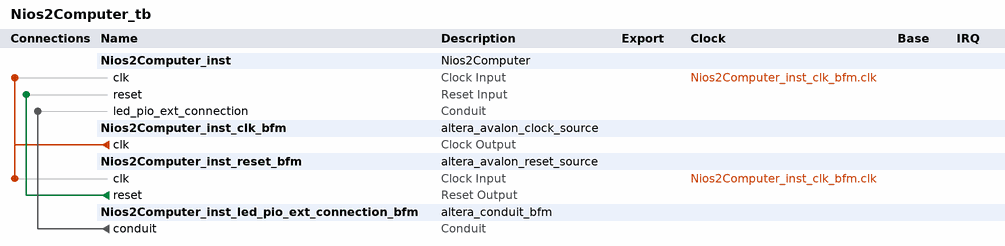
[diagram p0: system contents]
# Platform Designer (Qsys) system Nios2Computer_tb, Cyclone V 5CSEMA4U23C6
# Parameters at their usual value, and those the tool derives, are not listed.
package require -exact qsys 17.1
create_system Nios2Computer_tb
set_project_property DEVICE_FAMILY {Cyclone V}
set_project_property DEVICE 5CSEMA4U23C6

add_instance Nios2Computer_inst Nios2Computer 1.0

add_instance Nios2Computer_inst_clk_bfm altera_avalon_clock_source 17.1

add_instance Nios2Computer_inst_reset_bfm altera_avalon_reset_source 17.1
set_instance_parameter_value Nios2Computer_inst_reset_bfm ASSERT_HIGH_RESET 0
set_instance_parameter_value Nios2Computer_inst_reset_bfm INITIAL_RESET_CYCLES 50

add_instance Nios2Computer_inst_led_pio_ext_connection_bfm altera_conduit_bfm 17.1
set_instance_parameter_value Nios2Computer_inst_led_pio_ext_connection_bfm CLOCKED_SIGNAL false
set_instance_parameter_value Nios2Computer_inst_led_pio_ext_connection_bfm ENABLE_RESET false
set_instance_parameter_value Nios2Computer_inst_led_pio_ext_connection_bfm SIGNAL_DIRECTIONS input
set_instance_parameter_value Nios2Computer_inst_led_pio_ext_connection_bfm SIGNAL_WIDTHS 8

# connections
add_connection Nios2Computer_inst_clk_bfm.clk Nios2Computer_inst.clk clock
add_connection Nios2Computer_inst_clk_bfm.clk Nios2Computer_inst_reset_bfm.clk clock
add_connection Nios2Computer_inst_reset_bfm.reset Nios2Computer_inst.reset reset
add_connection Nios2Computer_inst_led_pio_ext_connection_bfm.conduit Nios2Computer_inst.led_pio_ext_connection conduit

set_interconnect_requirement {$system} qsys_mm.clockCrossingAdapter HANDSHAKE
set_interconnect_requirement {$system} qsys_mm.enableEccProtection FALSE
set_interconnect_requirement {$system} qsys_mm.insertDefaultSlave FALSE
set_interconnect_requirement {$system} qsys_mm.maxAdditionalLatency 1

save_system Nios2Computer_tb.qsys
